# EAGLE design HAP-CU-Hutschiene-3.0 (EAGLE 4.16)
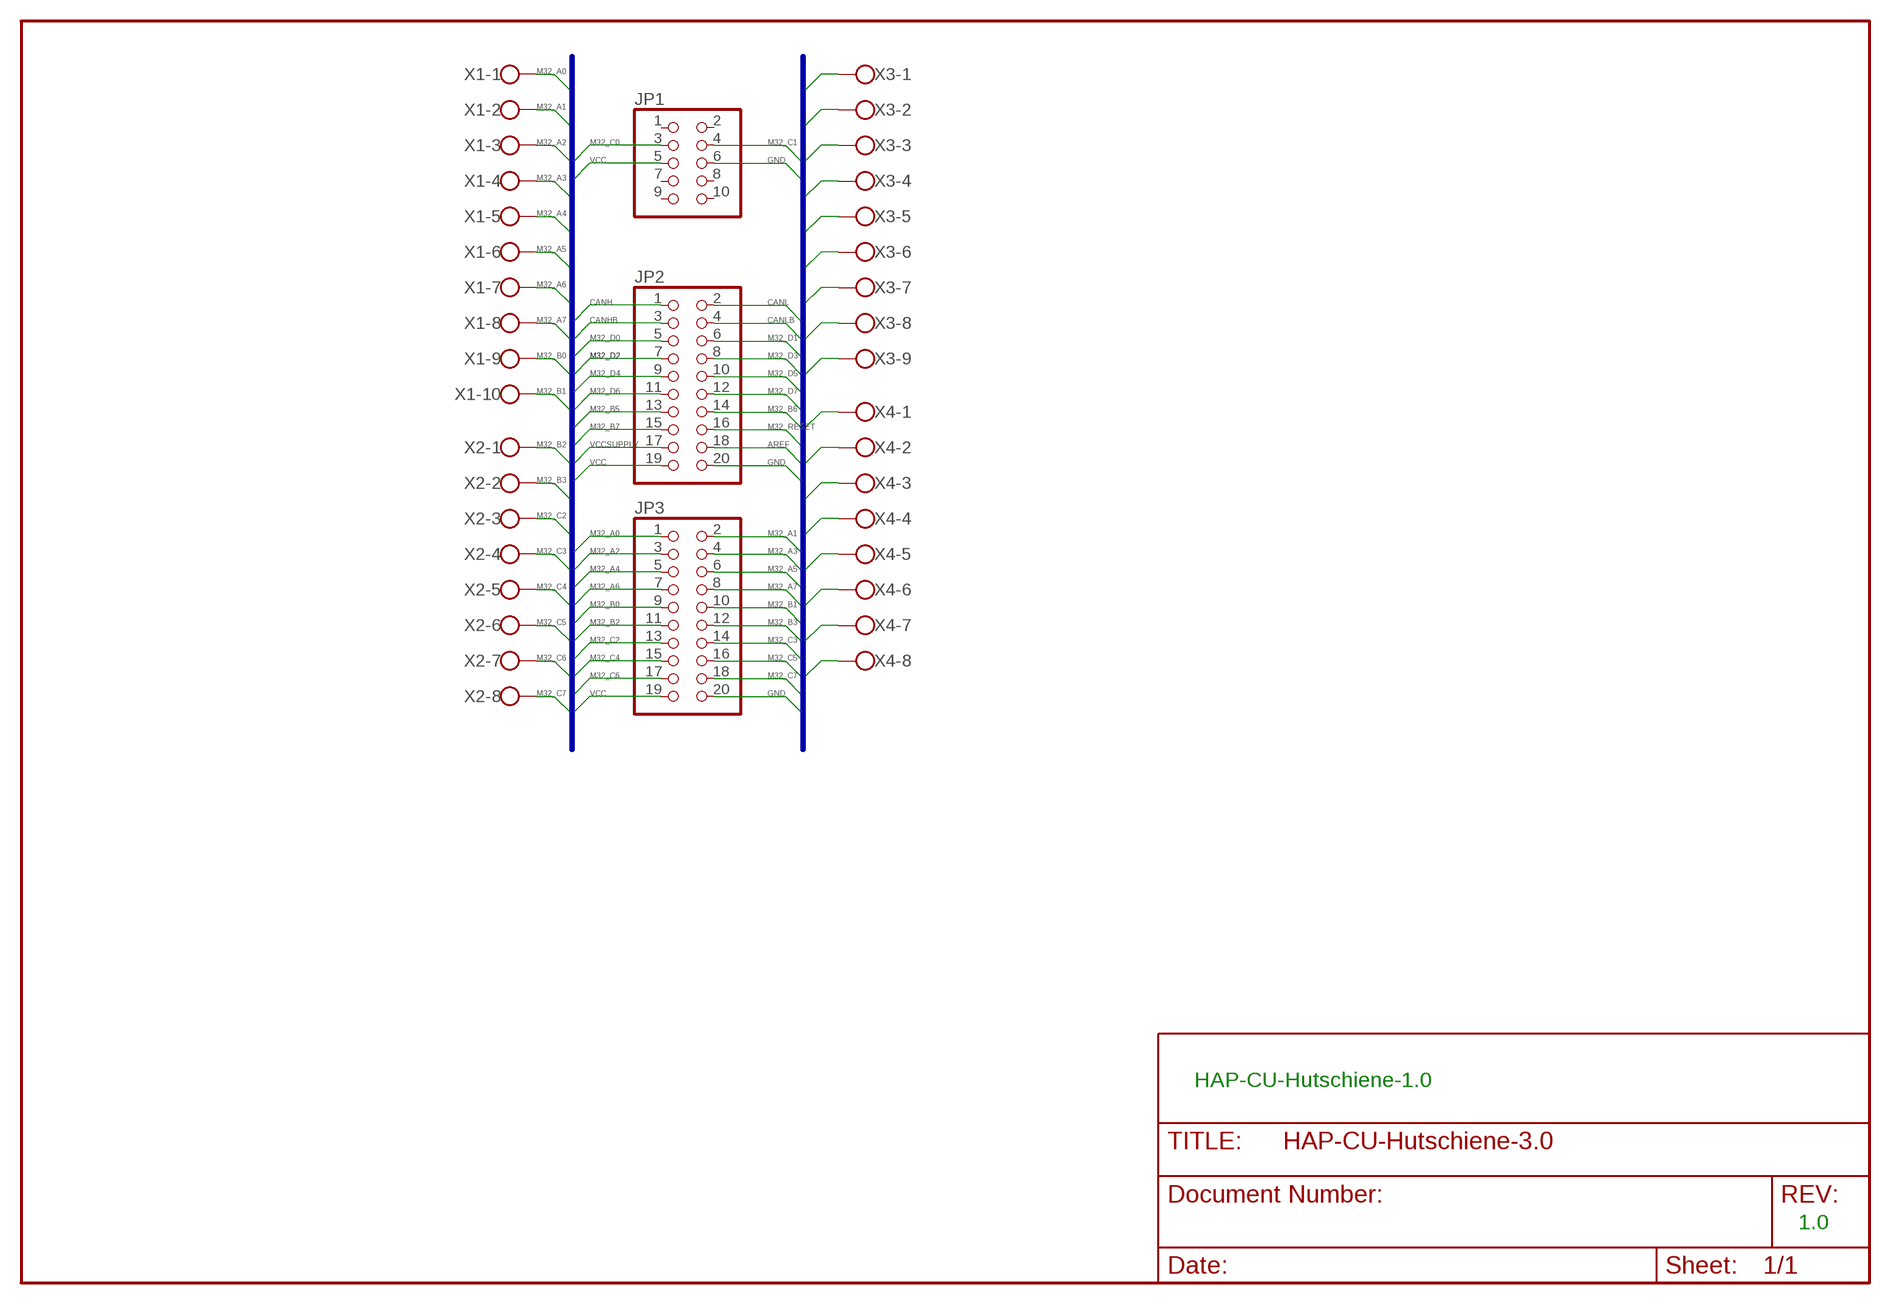
[diagram p0: schematic, sheet 1]

## Parts
JP1  PINHD-2X5  [2X05]
JP2  PINHD-2X10  [2X10]
JP3  PINHD-2X10  [2X10]
X1  W237-10P  [W237-10P]
X2  W237-08P  [W237-8P]
X3  W237-09P  [W237-9P]
X4  W237-08P  [W237-8P]

## Nets
AREF: JP2.18
CANH: JP2.1 X3.1
CANHB: JP2.3 X3.3
CANL: JP2.2 X3.2
CANLB: JP2.4 X3.4
GND [VCCSUPPLY]: JP1.6 JP2.20 JP3.20 X3.6
M32_A0: JP3.1 X1.1
M32_A1: JP3.2 X1.2
M32_A2: JP3.3 X1.3
M32_A3: JP3.4 X1.4
M32_A4: JP3.5 X1.5
M32_A5: JP3.6 X1.6
M32_A6: JP3.7 X1.7
M32_A7: JP3.8 X1.8
M32_B0: JP3.9 X1.9
M32_B1: JP3.10 X1.10
M32_B2: JP3.11 X2.1
M32_B3: JP3.12 X2.2
M32_B5: JP2.13
M32_B6: JP2.14
M32_B7: JP2.15
M32_C0: JP1.3 X4.6
M32_C1: JP1.4 X4.7
M32_C2: JP3.13 X2.3
M32_C3: JP3.14 X2.4
M32_C4: JP3.15 X2.5
M32_C5: JP3.16 X2.6
M32_C6: JP3.17 X2.7
M32_C7: JP3.18 X2.8
M32_D0: JP2.5 X3.7
M32_D1: JP2.6 X3.8
M32_D2: JP2.7 X3.9
M32_D3: JP2.8 X4.1
M32_D4: JP2.9 X4.2
M32_D5: JP2.10 X4.3
M32_D6: JP2.11 X4.4
M32_D7: JP2.12 X4.5
M32_RESET: JP2.16
VCC [VCCSUPPLY]: JP1.5 JP2.19 JP3.19 X4.8
VCCSUPPLY [VCCSUPPLY]: JP2.17 X3.5
Unconnected: JP1.1 JP1.2 JP1.7 JP1.8 JP1.9 JP1.10

## Buses
M32_RESET,M32_XTAL2,M32_XTAL1,M32_AREF,M32_AVCC,M32_AGND,M32_A[0..7],M32_B[0..7],M32_C[0..7],M32_D[0..7],VCC,GND,TXCAN,RXCAN,CANH,CANHB,CANL,CANLB,VCCSUPPLY,M32_XTAL1,M32_XTAL2,MCP_OSC1,MCP_OSC2,AREF

## Notes on the sheet
- HAP-CU-Hutschiene-1.0
- 1.0

## Library data of the parts
JP1 = pinhead:PINHD-2X5: PIN HEADER
JP2 JP3 = pinhead:PINHD-2X10: PIN HEADER
X1 = con-wago-508:W237-10P: WAGO SREW CLAMP
X2 X4 = con-wago-508:W237-08P: WAGO SREW CLAMP
X3 = con-wago-508:W237-09P: WAGO SREW CLAMP

## Net classes
1 Mains: width 2.997 mm, drill 1.27 mm
2 VCCSUPPLY: width 0.508 mm, drill 0.254 mm

## Board
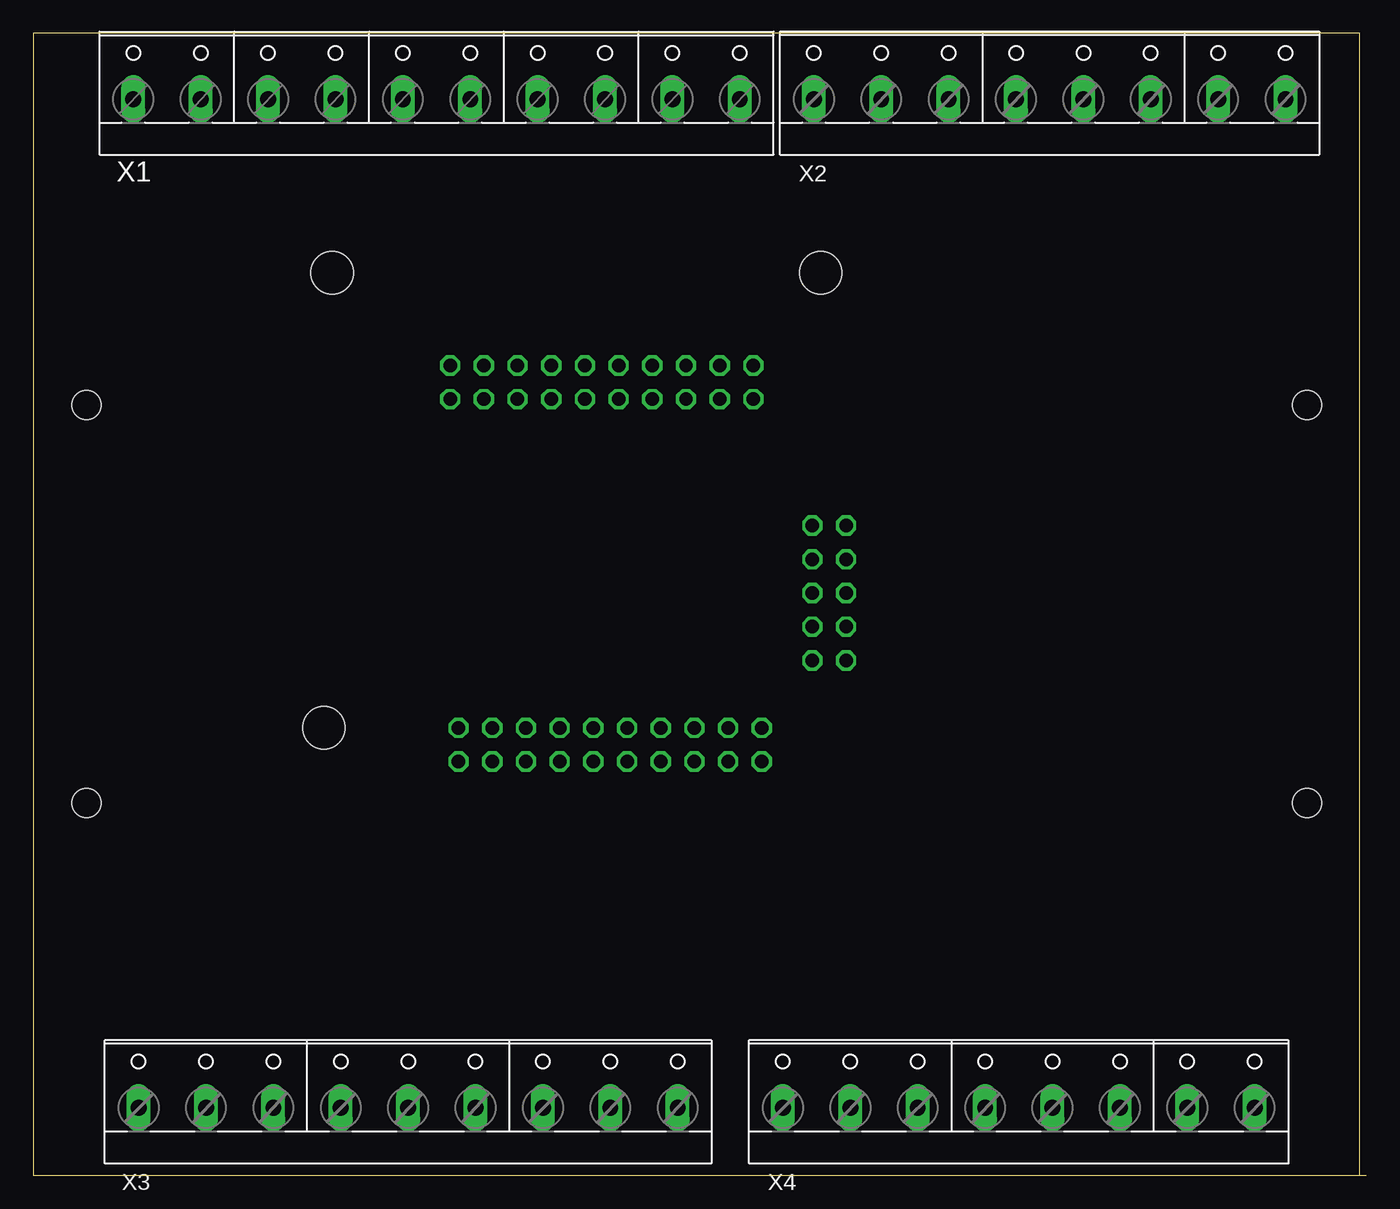
[diagram p1: board, top side]
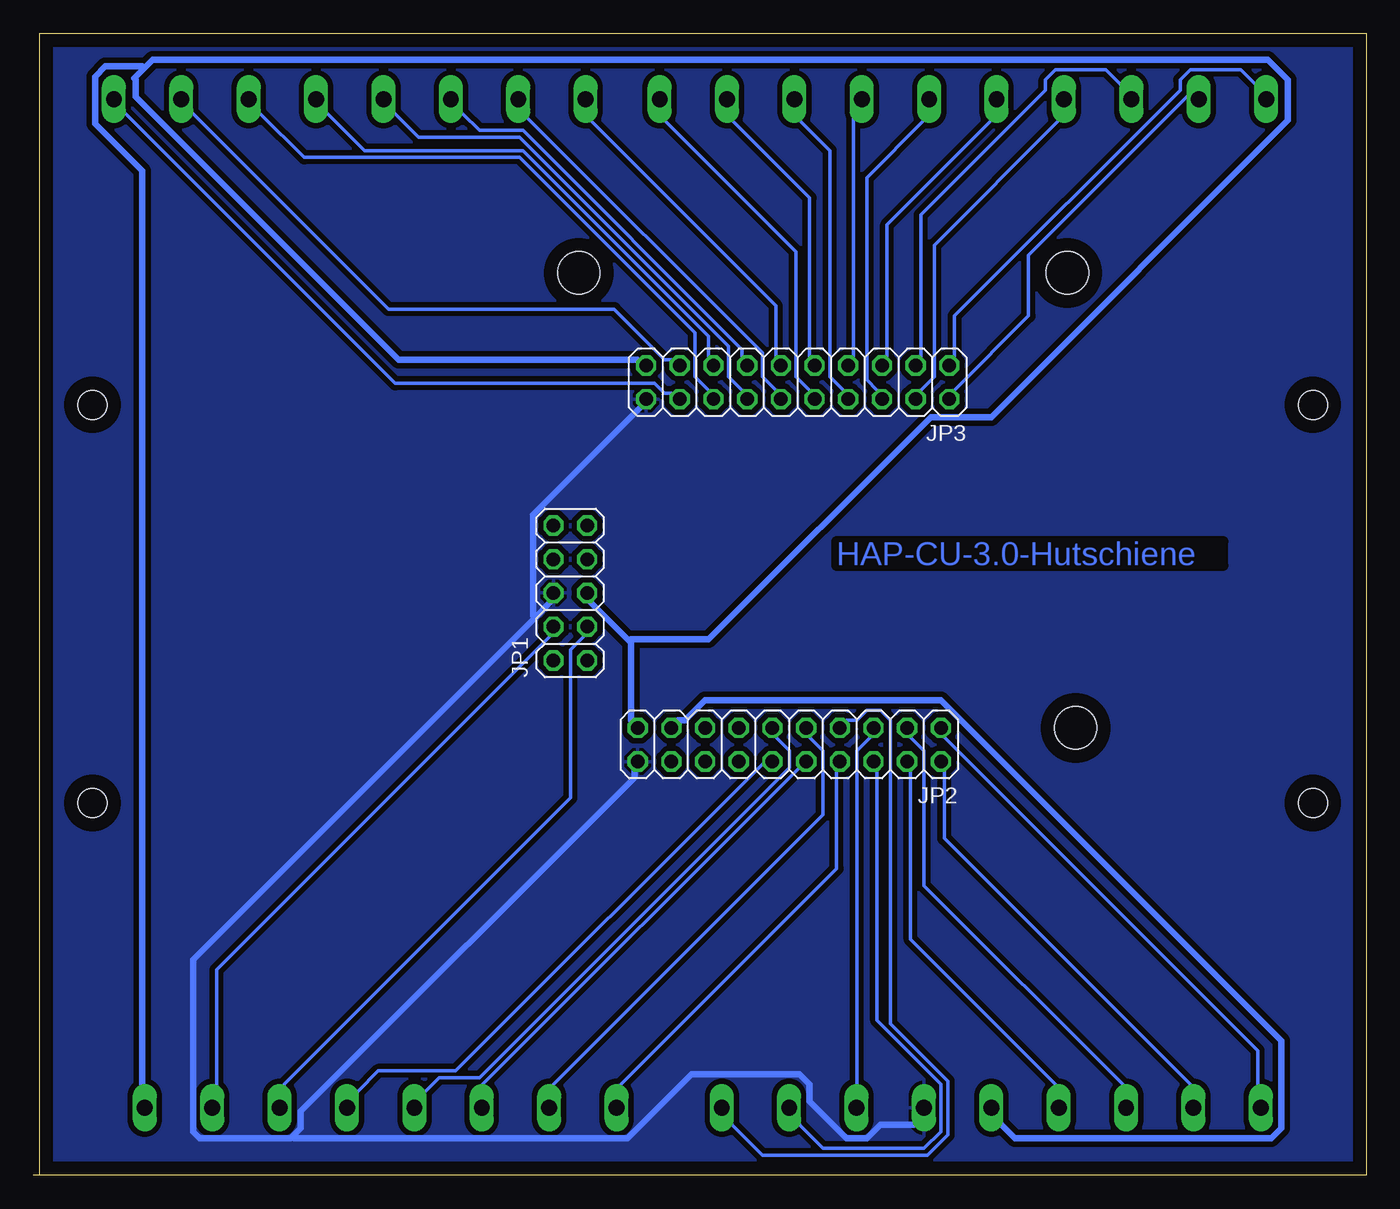
[diagram p2: board, bottom side, seen from below]

Size 100.5 x 86.08 mm. Coordinates in mm from the lower left corner, seen from the top.
Outline: 100,0 100,86.08 0,86.08 0,0 100,0
Outline: 100,0 100.5,0
Copper layers (1*16): Top 0.035mm / dielectric 1.5mm / Bottom 0.035mm
Design rules "default": minimum track width 10mil, minimum drill 24mil, track to track 8mil, track to pad 8mil, pad to pad 8mil, via to via 8mil, smd to smd 8mil, copper to edge 40mil, drill to drill 8mil, minimum pad ring 10mil, minimum via ring 8mil, stop-mask expansion 4mil, vias tented up to drill 0mil, thermal gap 10mil
Holes 3.2 mm at 59.37,68.02 21.91,33.73 22.54,68.02
Holes 2.2 mm at 4.03,58.07 4.03,28.07 96.03,28.07 96.03,58.07

### Footprints (pad centres in the part's own frame; a part is rotated, then mirrored left to right if it is on the bottom)
2X05 = drill 1.016 octagon: 1 -5.08,-1.27; 2 -5.08,1.27; 3 -2.54,-1.27; 4 -2.54,1.27; 5 0,-1.27; 6 0,1.27; 7 2.54,-1.27; 8 2.54,1.27; 9 5.08,-1.27; 10 5.08,1.27
2X10 = drill 1.016 octagon: 1 -11.43,-1.27; 2 -11.43,1.27; 3 -8.89,-1.27; 4 -8.89,1.27; 5 -6.35,-1.27; 6 -6.35,1.27; 7 -3.81,-1.27; 8 -3.81,1.27; 9 -1.27,-1.27; 10 -1.27,1.27; 11 1.27,-1.27; 12 1.27,1.27; 13 3.81,-1.27; 14 3.81,1.27; 15 6.35,-1.27; 16 6.35,1.27; 17 8.89,-1.27; 18 8.89,1.27; 19 11.43,-1.27; 20 11.43,1.27
W237-10P = drill 1.194 long: 1 -22.86,-0.635; 2 -17.78,-0.635; 3 -12.7,-0.635; 4 -7.62,-0.635; 5 -2.54,-0.635; 6 2.54,-0.635; 7 7.62,-0.635; 8 12.7,-0.635; 9 17.78,-0.635; 10 22.86,-0.635
W237-8P = drill 1.194 long: 1 -17.78,-0.635; 2 -12.7,-0.635; 3 -7.62,-0.635; 4 -2.54,-0.635; 5 2.54,-0.635; 6 7.62,-0.635; 7 12.7,-0.635; 8 17.78,-0.635
W237-9P = drill 1.194 long: 1 -20.32,-0.635; 2 -15.24,-0.635; 3 -10.16,-0.635; 4 -5.08,-0.635; 5 0,-0.635; 6 5.08,-0.635; 7 10.16,-0.635; 8 15.24,-0.635; 9 20.32,-0.635

### Placement (x,y rotation side)
JP1  60.01,43.89 90 bottom
JP2  43.5,32.46 180 bottom
JP3  42.86,59.77 180 bottom
X1  30.41,81.75 0 top
X2  76.63,81.75 0 top
X3  28.27,5.74 0 top
X4  74.3,5.74 0 top

### Tracks (layer width: path | path; a pad name or v marks a point on that pad's centre or on a via)
CANH
  Bottom 0.254: JP2.1 31.81,33.03 8.19,9.4 8.19,6.86 X3.1
CANHB
  Bottom 0.254: JP2.3 34.35,33.03 33.34,32.01 33.34,21.85 18.35,6.86 X3.3
CANL
  Bottom 0.254: JP2.2 31.81,30.49 31.81,25.41 13.27,6.86 X3.2
CANLB
  Bottom 0.254: JP2.4 34.35,30.49 34.35,17.79 23.43,6.86 X3.4
GND
  Bottom 0.508: 80.96,2.93 81.09,2.8 87.95,2.8 88.45,3.31 88.45,16.26 62.67,42.04 | 80.96,2.93 80.33,3.56 80.33,4.83 55.18,29.98 55.18,30.49 JP2.20 | 62.67,42.04 61.53,43.19 JP1.6 | JP3.20 54.67,57.92 62.8,49.79 62.8,42.17 62.67,42.04 | X3.6 34.1,3.82 36.64,3.82 37.65,2.8 39.18,2.8 41.97,5.59 41.97,6.86 42.73,7.63 50.86,7.63 55.69,2.8 80.83,2.8 80.96,2.93
  pour Bottom (isolate 0.406): -0.7,86.62 99.63,86.62 99.63,0.26 -0.7,0.26
M32_A0
  Bottom 0.254: JP3.1 31.05,61.73 31.05,64.78 14.03,81.79 14.03,82.56 13.27,83.32 9.46,83.32 8.44,82.3 X1.1
M32_A1
  Bottom 0.254: JP3.2 31.05,59.19 25.46,64.78 25.46,69.35 13.52,81.29 X1.2
M32_A2
  Bottom 0.254: JP3.3 33.59,61.73 33.59,72.4 24.19,81.79 24.19,82.56 23.43,83.32 19.62,83.32 18.6,82.3 X1.3
M32_A3
  Bottom 0.254: JP3.4 33.59,59.19 32.57,60.2 32.57,70.11 23.18,79.51 X1.4
M32_A4
  Bottom 0.254: JP3.5 36.13,61.73 36.13,71.63 28.26,79.51 X1.5
M32_A5
  Bottom 0.254: JP3.6 36.89,59.19 37.65,59.95 37.65,75.19 33.34,79.51 X1.6
M32_A6
  Bottom 0.254: JP3.7 38.67,61.73 38.67,79.76 X1.7
M32_A7
  Bottom 0.254: JP3.8 39.43,59.19 40.45,60.2 40.45,77.22 42.73,79.51 X1.8
M32_B0
  Bottom 0.254: JP3.9 41.97,61.73 41.97,73.67 47.81,79.51 X1.9
M32_B1
  Bottom 0.254: JP3.10 41.97,59.19 42.99,60.2 42.99,69.6 52.89,79.51 X1.10
M32_B2
  Bottom 0.254: JP3.11 44.51,61.73 44.51,65.54 58.48,79.51 X2.1
M32_B3
  Bottom 0.254: JP3.12 44.51,59.19 45.53,60.2 45.53,61.98 63.31,79.76 X2.2
M32_C0
  Bottom 0.254: JP1.3 58.99,40.65 60.01,39.63 60.01,28.45 81.6,6.86 X4.6
M32_C1
  Bottom 0.254: JP1.4 61.53,40.65 86.68,15.5 86.68,6.86 X4.7
M32_C2
  Bottom 0.254: JP3.13 47.05,61.73 47.05,62.24 63.56,78.75 66.86,78.75 68.13,80.02 X2.3
M32_C3
  Bottom 0.254: JP3.14 47.05,59.19 48.07,60.2 48.07,62.49 63.82,78.24 71.44,78.24 73.21,80.02 X2.4
M32_C4
  Bottom 0.254: JP3.15 49.59,61.73 49.59,63.25 63.56,77.22 75.5,77.22 78.29,80.02 X2.5
M32_C5
  Bottom 0.254: JP3.16 49.59,59.19 50.61,60.2 50.61,63.51 63.82,76.71 80.07,76.71 83.37,80.02 X2.6
M32_C6
  Bottom 0.254: JP3.17 52.39,61.47 52.89,61.47 56.7,65.28 73.72,65.28 88.45,80.02 X2.7
M32_C7
  Bottom 0.254: JP3.18 52.39,58.93 52.89,58.93 53.66,59.7 73.21,59.7 93.53,80.02 X2.8
M32_D0
  Bottom 0.254: JP2.5 37.4,33.03 38.42,32.01 38.42,6.86 X3.7
M32_D1
  Bottom 0.254: JP2.6 36.89,30.49 36.89,11.69 32.07,6.86 32.07,3.31 33.34,2.04 40.96,2.04 42.73,3.82 X3.8
M32_D2
  Bottom 0.254: JP2.7 39.18,34.3 38.42,34.3 37.65,35.06 36.64,35.06 35.88,34.3 35.88,11.44 31.56,7.12 31.56,3.05 33.08,1.53 45.53,1.53 47.81,3.82 X3.9
M32_D3
  Bottom 0.254: JP2.8 39.94,30.49 39.94,23.12 56.2,6.86 X4.1
M32_D4
  Bottom 0.254: JP2.9 41.97,33.03 40.96,32.01 40.96,27.18 61.28,6.86 X4.2
M32_D5
  Bottom 0.254: JP2.10 42.73,30.74 66.61,6.86 X4.3
M32_D6
  Bottom 0.254: JP2.11 44.51,33.03 43.5,32.01 43.5,30.74 66.86,7.37 69.91,7.37 70.93,6.36 X4.4
M32_D7
  Bottom 0.254: JP2.12 45.53,30.99 68.64,7.88 74.48,7.88 76.01,6.36 X4.5
VCC
  Bottom 0.508: 55.56,40.27 58.48,43.19 JP1.5 | 55.56,40.27 55.43,40.14 55.43,34.3 JP2.19 | JP3.19 54.93,61.47 72.96,61.47 92.77,81.29 92.77,82.56 92.9,82.68 92.14,83.44 | X4.8 92.26,6.86 92.26,75.7 95.82,79.25 95.82,82.81 95.06,83.57 92.26,83.57 92.14,83.44 | 55.56,40.27 55.43,40.39 49.59,40.39 32.83,57.16 28.26,57.16 5.9,79.51 5.9,82.56 7.43,84.08 91.5,84.08 92.14,83.44
VCCSUPPLY
  Bottom 0.508: JP2.17 51.88,34.3 51.37,34.3 49.85,35.82 32.07,35.82 6.41,10.17 6.41,3.56 7.17,2.8 26.48,2.8 27.49,3.82 X3.5

### Text on the board
Bottom: HAP-CU-3.0-Hutschiene